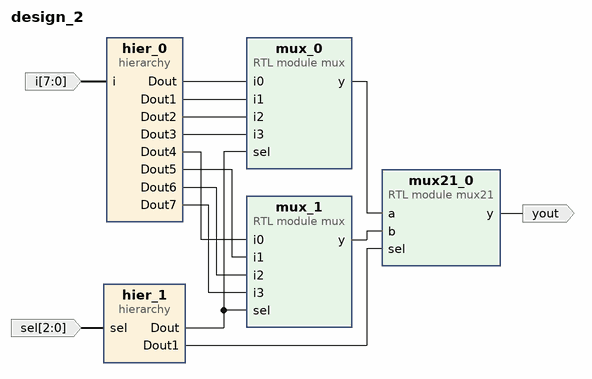
[diagram p0: block diagram of the top level]
# Vivado block design design_2, xc7a100tcsg324-1, Vivado 2023.2
create_bd_design design_2

create_bd_port -dir I -from 7 -to 0 i
create_bd_port -dir O yout
create_bd_port -dir I -from 2 -to 0 sel

create_bd_cell -type module -reference mux mux_0
create_bd_cell -type module -reference mux mux_1
create_bd_cell -type module -reference mux21 mux21_0
create_bd_cell -type hier hier_0
create_bd_cell -type hier hier_1

# ---- hierarchy /hier_0 ----
current_bd_instance /hier_0
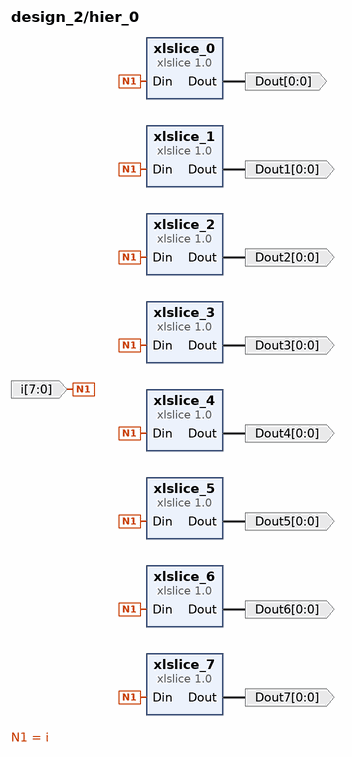
[diagram p1: block diagram inside /hier_0]
create_bd_pin -dir I -from 7 -to 0 i
create_bd_pin -dir O -from 0 -to 0 Dout
create_bd_pin -dir O -from 0 -to 0 Dout1
create_bd_pin -dir O -from 0 -to 0 Dout2
create_bd_pin -dir O -from 0 -to 0 Dout3
create_bd_pin -dir O -from 0 -to 0 Dout4
create_bd_pin -dir O -from 0 -to 0 Dout5
create_bd_pin -dir O -from 0 -to 0 Dout6
create_bd_pin -dir O -from 0 -to 0 Dout7

create_bd_cell -type ip -vlnv xilinx.com:ip:xlslice:1.0 xlslice_0
set_property -dict {CONFIG.DIN_WIDTH 8} [get_bd_cells xlslice_0]
create_bd_cell -type ip -vlnv xilinx.com:ip:xlslice:1.0 xlslice_1
set_property -dict {CONFIG.DIN_FROM 1 CONFIG.DIN_TO 1 CONFIG.DIN_WIDTH 8} [get_bd_cells xlslice_1]
create_bd_cell -type ip -vlnv xilinx.com:ip:xlslice:1.0 xlslice_2
set_property -dict {CONFIG.DIN_FROM 2 CONFIG.DIN_TO 2 CONFIG.DIN_WIDTH 8} [get_bd_cells xlslice_2]
create_bd_cell -type ip -vlnv xilinx.com:ip:xlslice:1.0 xlslice_3
set_property -dict {CONFIG.DIN_FROM 3 CONFIG.DIN_TO 3 CONFIG.DIN_WIDTH 8} [get_bd_cells xlslice_3]
create_bd_cell -type ip -vlnv xilinx.com:ip:xlslice:1.0 xlslice_4
set_property -dict {CONFIG.DIN_FROM 4 CONFIG.DIN_TO 4 CONFIG.DIN_WIDTH 8} [get_bd_cells xlslice_4]
create_bd_cell -type ip -vlnv xilinx.com:ip:xlslice:1.0 xlslice_5
set_property -dict {CONFIG.DIN_FROM 5 CONFIG.DIN_TO 5 CONFIG.DIN_WIDTH 8} [get_bd_cells xlslice_5]
create_bd_cell -type ip -vlnv xilinx.com:ip:xlslice:1.0 xlslice_6
set_property -dict {CONFIG.DIN_FROM 6 CONFIG.DIN_TO 6 CONFIG.DIN_WIDTH 8} [get_bd_cells xlslice_6]
create_bd_cell -type ip -vlnv xilinx.com:ip:xlslice:1.0 xlslice_7
set_property -dict {CONFIG.DIN_FROM 7 CONFIG.DIN_TO 7 CONFIG.DIN_WIDTH 8} [get_bd_cells xlslice_7]

# ---- hierarchy /hier_1 ----
current_bd_instance /hier_1
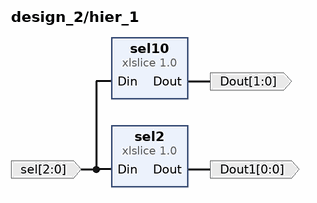
[diagram p2: block diagram inside /hier_1]
create_bd_pin -dir I -from 2 -to 0 sel
create_bd_pin -dir O -from 1 -to 0 Dout
create_bd_pin -dir O -from 0 -to 0 Dout1

create_bd_cell -type ip -vlnv xilinx.com:ip:xlslice:1.0 sel10
set_property -dict {CONFIG.DIN_FROM 1 CONFIG.DIN_TO 0 CONFIG.DIN_WIDTH 3} [get_bd_cells sel10]
create_bd_cell -type ip -vlnv xilinx.com:ip:xlslice:1.0 sel2
set_property -dict {CONFIG.DIN_FROM 2 CONFIG.DIN_TO 2 CONFIG.DIN_WIDTH 3} [get_bd_cells sel2]

# ---- connections ----

current_bd_instance /hier_0
connect_bd_net [get_bd_pins i] \
  [get_bd_pins xlslice_1/Din] [get_bd_pins xlslice_2/Din] [get_bd_pins xlslice_3/Din] [get_bd_pins xlslice_4/Din] \
  [get_bd_pins xlslice_5/Din] [get_bd_pins xlslice_6/Din] [get_bd_pins xlslice_7/Din] [get_bd_pins xlslice_0/Din]
connect_bd_net [get_bd_pins xlslice_0/Dout] [get_bd_pins Dout]
connect_bd_net [get_bd_pins xlslice_1/Dout] [get_bd_pins Dout1]
connect_bd_net [get_bd_pins xlslice_2/Dout] [get_bd_pins Dout2]
connect_bd_net [get_bd_pins xlslice_3/Dout] [get_bd_pins Dout3]
connect_bd_net [get_bd_pins xlslice_4/Dout] [get_bd_pins Dout4]
connect_bd_net [get_bd_pins xlslice_5/Dout] [get_bd_pins Dout5]
connect_bd_net [get_bd_pins xlslice_6/Dout] [get_bd_pins Dout6]
connect_bd_net [get_bd_pins xlslice_7/Dout] [get_bd_pins Dout7]

current_bd_instance /hier_1
connect_bd_net [get_bd_pins sel] [get_bd_pins sel2/Din] [get_bd_pins sel10/Din]
connect_bd_net -net xlslice_0_Dout1 [get_bd_pins sel2/Dout] [get_bd_pins Dout1]
connect_bd_net -net xlslice_1_Dout1 [get_bd_pins sel10/Dout] [get_bd_pins Dout]

current_bd_instance /
connect_bd_net [get_bd_ports i] [get_bd_pins hier_0/i]
connect_bd_net [get_bd_pins mux21_0/y] [get_bd_ports yout]
connect_bd_net [get_bd_pins mux_0/y] [get_bd_pins mux21_0/a]
connect_bd_net [get_bd_pins mux_1/y] [get_bd_pins mux21_0/b]
connect_bd_net [get_bd_ports sel] [get_bd_pins hier_1/sel]
connect_bd_net -net xlslice_0_Dout [get_bd_pins hier_0/Dout] [get_bd_pins mux_0/i0]
connect_bd_net -net xlslice_0_Dout1 [get_bd_pins hier_1/Dout1] [get_bd_pins mux21_0/sel]
connect_bd_net -net xlslice_1_Dout [get_bd_pins hier_0/Dout1] [get_bd_pins mux_0/i1]
connect_bd_net -net xlslice_1_Dout1 [get_bd_pins hier_1/Dout] [get_bd_pins mux_0/sel] [get_bd_pins mux_1/sel]
connect_bd_net -net xlslice_2_Dout [get_bd_pins hier_0/Dout2] [get_bd_pins mux_0/i2]
connect_bd_net -net xlslice_3_Dout [get_bd_pins hier_0/Dout3] [get_bd_pins mux_0/i3]
connect_bd_net -net xlslice_4_Dout [get_bd_pins hier_0/Dout4] [get_bd_pins mux_1/i0]
connect_bd_net -net xlslice_5_Dout [get_bd_pins hier_0/Dout5] [get_bd_pins mux_1/i1]
connect_bd_net -net xlslice_6_Dout [get_bd_pins hier_0/Dout6] [get_bd_pins mux_1/i2]
connect_bd_net -net xlslice_7_Dout [get_bd_pins hier_0/Dout7] [get_bd_pins mux_1/i3]

validate_bd_design
save_bd_design
